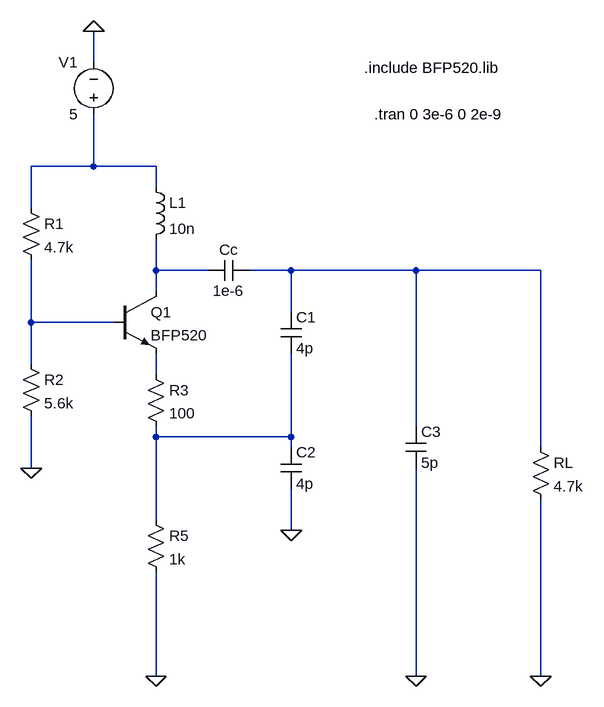
[diagram p0: schematic default-oscillator.asc]
default-oscillator.asc, the LTspice schematic file:
Version 4
SHEET 1 968 1136
WIRE 208 176 208 128
WIRE 208 336 208 256
WIRE 208 336 112 336
WIRE 304 336 208 336
WIRE 304 368 304 336
WIRE 112 400 112 336
WIRE 304 496 304 448
WIRE 384 496 304 496
WIRE 512 496 448 496
WIRE 704 496 512 496
WIRE 896 496 704 496
WIRE 304 528 304 496
WIRE 512 560 512 496
WIRE 112 576 112 480
WIRE 240 576 112 576
WIRE 112 640 112 576
WIRE 304 656 304 624
WIRE 704 736 704 496
WIRE 304 752 304 736
WIRE 512 752 512 624
WIRE 512 752 304 752
WIRE 512 768 512 752
WIRE 896 768 896 496
WIRE 112 800 112 720
WIRE 304 880 304 752
WIRE 512 896 512 832
WIRE 304 1120 304 960
WIRE 704 1120 704 800
WIRE 896 1120 896 848
FLAG 208 128 0
FLAG 112 800 0
FLAG 304 1120 0
FLAG 512 896 0
FLAG 704 1120 0
FLAG 896 1120 0
SYMBOL npn 240 528 R0
SYMATTR InstName Q1
SYMATTR Value BFP520
SYMBOL Cap 496 560 R0
SYMATTR InstName C1
SYMATTR Value 4p
SYMBOL Cap 496 768 R0
SYMATTR InstName C2
SYMATTR Value 4p
SYMBOL Cap 448 480 R90
WINDOW 0 0 32 VBottom 2
WINDOW 3 32 32 VTop 2
SYMATTR InstName Cc
SYMATTR Value 1e-6
SYMBOL Res 96 384 R0
SYMATTR InstName R1
SYMATTR Value 4.7k
SYMBOL Res 96 624 R0
SYMATTR InstName R2
SYMATTR Value 5.6k
SYMBOL Res 288 640 R0
SYMATTR InstName R3
SYMATTR Value 100
SYMBOL Res 880 752 R0
SYMATTR InstName RL
SYMATTR Value 4.7k
SYMBOL Res 288 864 R0
SYMATTR InstName R5
SYMATTR Value 1k
SYMBOL cap 688 736 R0
SYMATTR InstName C3
SYMATTR Value 5p
SYMBOL ind 288 352 R0
SYMATTR InstName L1
SYMATTR Value 10n
SYMBOL Voltage 208 272 R180
WINDOW 0 24 96 Left 2
WINDOW 3 24 16 Left 2
SYMATTR InstName V1
SYMATTR Value 5
TEXT 624 184 Left 2 !.include BFP520.lib
TEXT 640 256 Left 2 !.tran 0 3e-6 0 2e-9

The netlist it stands for:
* default-oscillator.asc
Q1 N002 N004 N005 0 BFP520
C1 N003 N006 4p
C2 N006 0 4p
Cc N003 N002 1e-6
R1 N001 N004 4.7k
R2 N004 0 5.6k
R3 N005 N006 100
RL N003 0 4.7k
R5 N006 0 1k
C3 N003 0 5p
L1 N001 N002 10n
V1 N001 0 5
.model NPN NPN
.model PNP PNP
.lib standard.bjt
.include BFP520.lib
.tran 0 3e-6 0 2e-9
.backanno
.end